# Altium schematic sheet EDU_High-Speed-Design_CPU_Power.SchDoc: CPU Power
size 558 x 431 mm; Date: not used; ApprovedBy: not used; CheckedBy: not used; Author: not used; DrawnBy: not used; Organization: not used; Address4: not used; SheetNumber: 12; SheetTotal: 26; Time: not used; ImagePath: not used; Application_BuildNumber: not used
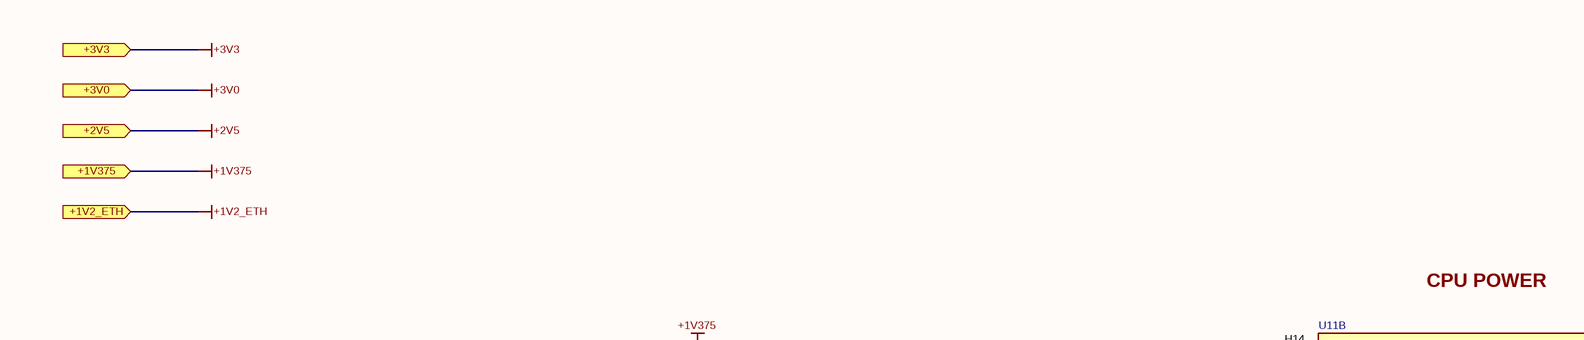
[diagram p0: EDU_High-Speed-Design_CPU_Power.SchDoc, top left]
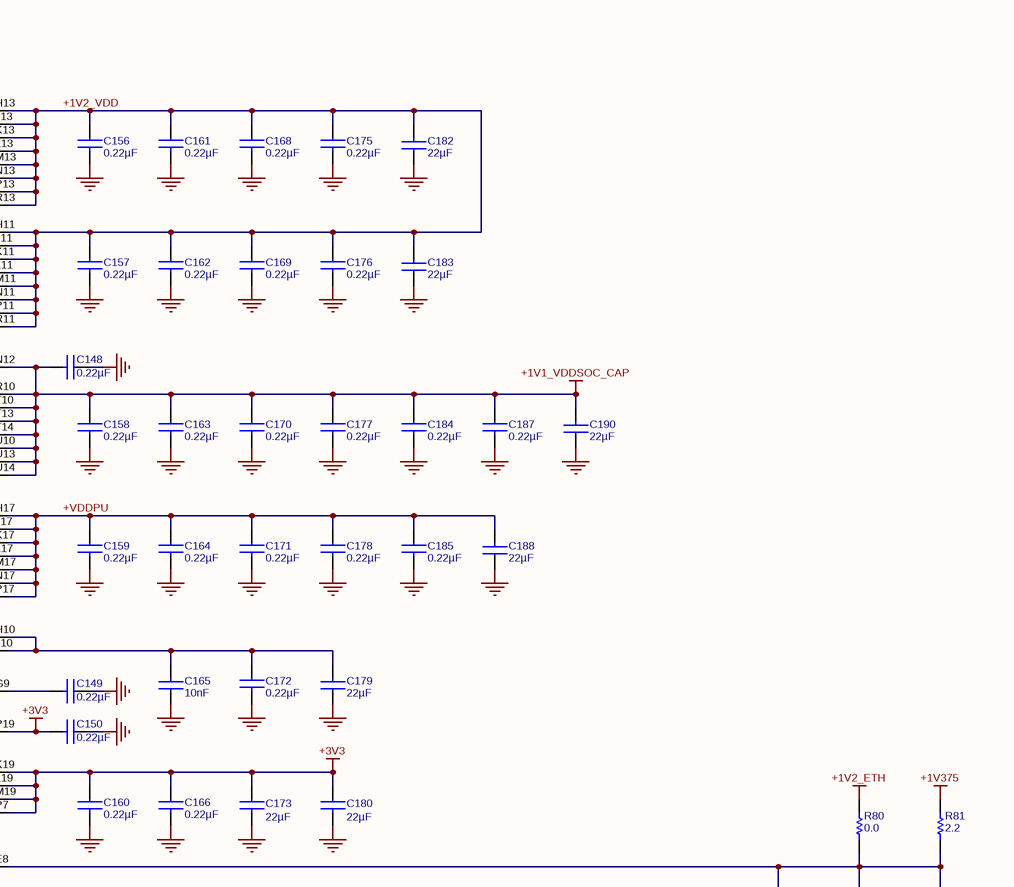
[diagram p1: EDU_High-Speed-Design_CPU_Power.SchDoc, top right]
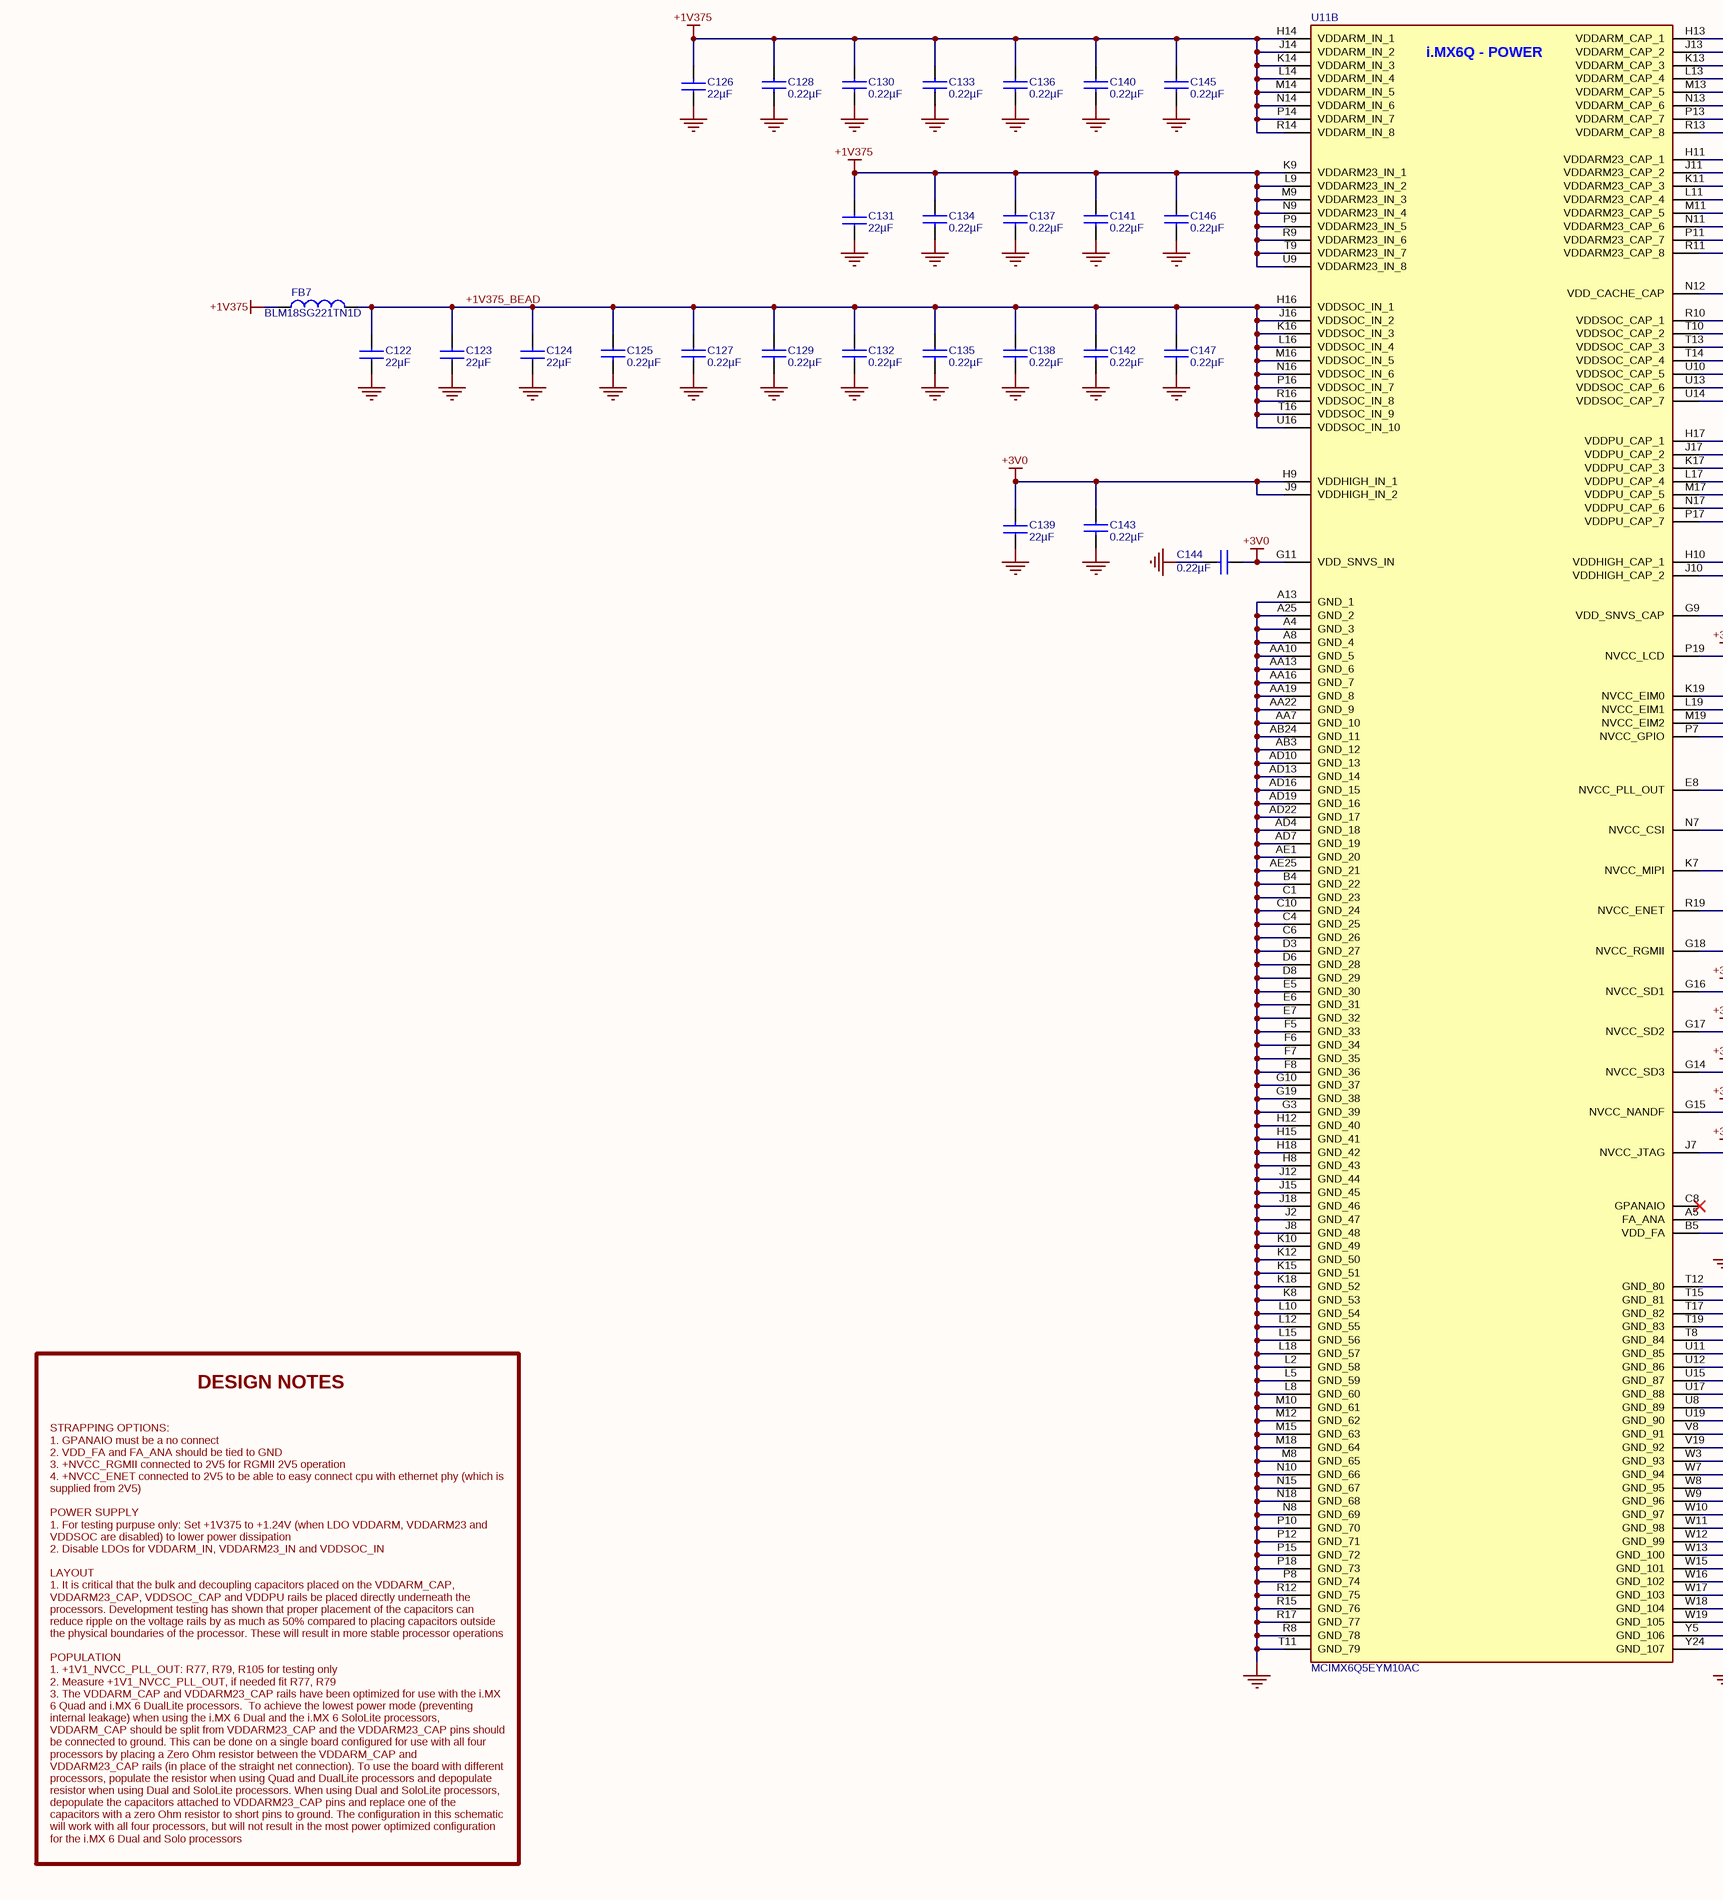
[diagram p2: EDU_High-Speed-Design_CPU_Power.SchDoc, bottom left]
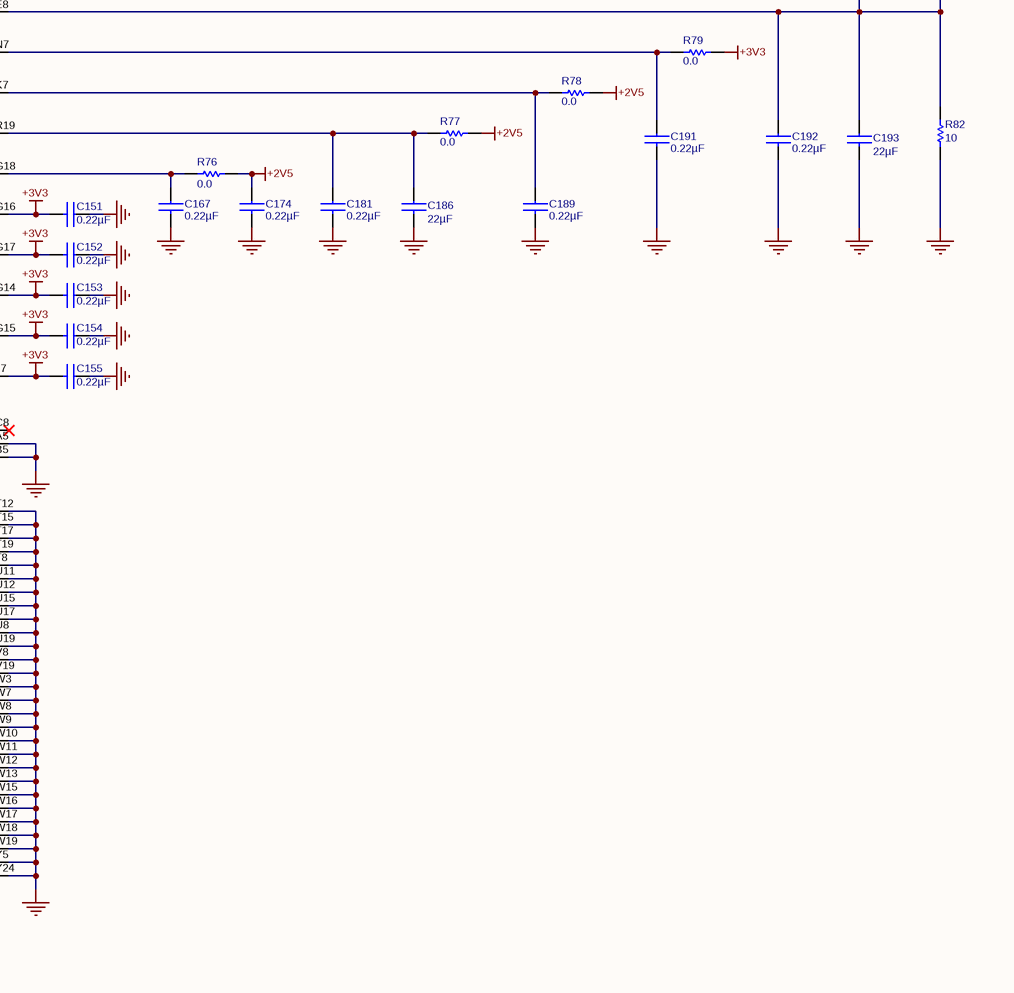
[diagram p3: EDU_High-Speed-Design_CPU_Power.SchDoc, bottom right]

## Parts
C122  22µF  [C0603]
C123  22µF  [C0603]
C124  22µF  [C0603]
C125  0.22µF  [C0402]
C126  22µF  [C0603]
C127  0.22µF  [C0402]
C128  0.22µF  [C0402]
C129  0.22µF  [C0402]
C130  0.22µF  [C0402]
C131  22µF  [C0603]
C132  0.22µF  [C0402]
C133  0.22µF  [C0402]
C134  0.22µF  [C0402]
C135  0.22µF  [C0402]
C136  0.22µF  [C0402]
C137  0.22µF  [C0402]
C138  0.22µF  [C0402]
C139  22µF  [C0603]
C140  0.22µF  [C0402]
C141  0.22µF  [C0402]
C142  0.22µF  [C0402]
C143  0.22µF  [C0402]
C144  0.22µF  [C0402]
C145  0.22µF  [C0402]
C146  0.22µF  [C0402]
C147  0.22µF  [C0402]
C148  0.22µF  [C0402]
C149  0.22µF  [C0402]
C150  0.22µF  [C0402]
C151  0.22µF  [C0402]
C152  0.22µF  [C0402]
C153  0.22µF  [C0402]
C154  0.22µF  [C0402]
C155  0.22µF  [C0402]
C156  0.22µF  [C0402]
C157  0.22µF  [C0402]
C158  0.22µF  [C0402]
C159  0.22µF  [C0402]
C160  0.22µF  [C0402]
C161  0.22µF  [C0402]
C162  0.22µF  [C0402]
C163  0.22µF  [C0402]
C164  0.22µF  [C0402]
C165  10nF  [C0402]
C166  0.22µF  [C0402]
C167  0.22µF  [C0402]
C168  0.22µF  [C0402]
C169  0.22µF  [C0402]
C170  0.22µF  [C0402]
C171  0.22µF  [C0402]
C172  0.22µF  [C0402]
C173  22µF  [C0603]
C174  0.22µF  [C0402]
C175  0.22µF  [C0402]
C176  0.22µF  [C0402]
C177  0.22µF  [C0402]
C178  0.22µF  [C0402]
C179  22µF  [C0603]
C180  22µF  [C0603]
C181  0.22µF  [C0402]
C182  22µF  [C0603]
C183  22µF  [C0603]
C184  0.22µF  [C0402]
C185  0.22µF  [C0402]
C186  22µF  [C0603]
C187  0.22µF  [C0402]
C188  22µF  [C0603]
C189  0.22µF  [C0402]
C190  22µF  [C0603]
C191  0.22µF  [C0402]
C192  0.22µF  [C0402]
C193  22µF  [C0603]
FB7  BLM18SG221TN1D  [L0603]
R76  0.0  [R0402]
R77  0.0  [R0402]
R78  0.0  [R0402]
R79  0.0  [R0402]
R80  0.0  [R0402]
R81  2.2  [R0402]
R82  10  [R0402]
U11  MCIMX6Q5EYM10AC  [MCIMX6Q5EYM10AC]  (part B of 15)

## Ports
+1V2_ETH (in), +1V375 (in), +2V5 (in), +3V0 (in), +3V3 (in)

## Nets
+1V1_VDDSOC_CAP: C148.2 C158.1 C163.1 C170.1 C177.1 C184.1 C187.1 C190.2 U11.N12(VDD_CACHE_CAP) U11.R10(VDDSOC_CAP_1) U11.T10(VDDSOC_CAP_2) U11.T13(VDDSOC_CAP_3) U11.T14(VDDSOC_CAP_4) U11.U10(VDDSOC_CAP_5) U11.U13(VDDSOC_CAP_6) U11.U14(VDDSOC_CAP_7)
+1V2_ETH: R80.1 ; port +1V2_ETH
+1V375: C126.2 C128.1 C130.1 C131.2 C133.1 C134.1 C136.1 C137.1 C140.1 C141.1 C145.1 C146.1 FB7.1 R81.2 U11.H14(VDDARM_IN_1) U11.J14(VDDARM_IN_2) U11.K9(VDDARM23_IN_1) U11.K14(VDDARM_IN_3) U11.L9(VDDARM23_IN_2) U11.L14(VDDARM_IN_4) U11.M9(VDDARM23_IN_3) U11.M14(VDDARM_IN_5) U11.N9(VDDARM23_IN_4) U11.N14(VDDARM_IN_6) U11.P9(VDDARM23_IN_5) U11.P14(VDDARM_IN_7) U11.R9(VDDARM23_IN_6) U11.R14(VDDARM_IN_8) U11.T9(VDDARM23_IN_7) U11.U9(VDDARM23_IN_8) ; port +1V375
+2V5: C174.1 R76.1 R77.2 R78.2 ; port +2V5
+3V0: C139.2 C143.1 C144.1 U11.G11(VDD_SNVS_IN) U11.H9(VDDHIGH_IN_1) U11.J9(VDDHIGH_IN_2) ; port +3V0
+3V3: C150.2 C151.2 C152.2 C153.2 C154.2 C155.2 C160.1 C166.1 C173.1 C180.1 R79.2 U11.G14(NVCC_SD3) U11.G15(NVCC_NANDF) U11.G16(NVCC_SD1) U11.G17(NVCC_SD2) U11.J7(NVCC_JTAG) U11.K19(NVCC_EIM0) U11.L19(NVCC_EIM1) U11.M19(NVCC_EIM2) U11.P7(NVCC_GPIO) U11.P19(NVCC_LCD) ; port +3V3
GND: C122.1 C123.1 C124.1 C125.2 C126.1 C127.2 C128.2 C129.2 C130.2 C131.1 C132.2 C133.2 C134.2 C135.2 C136.2 C137.2 C138.2 C139.1 C140.2 C141.2 C142.2 C143.2 C144.2 C145.2 C146.2 C147.2 C148.1 C149.1 C150.1 C151.1 C152.1 C153.1 C154.1 C155.1 C156.2 C157.2 C158.2 C159.2 C160.2 C161.2 C162.2 C163.2 C164.2 C165.1 C166.2 C167.2 C168.2 C169.2 C170.2 C171.2 C172.2 C173.2 C174.2 C175.2 C176.2 C177.2 C178.2 C179.1 C180.2 C181.2 C182.1 C183.1 C184.2 C185.2 C186.2 C187.2 C188.1 C189.2 C190.1 C191.2 C192.2 C193.2 R82.2 U11.A4(GND_3) U11.A5(FA_ANA) U11.A8(GND_4) U11.A13(GND_1) U11.A25(GND_2) U11.AA7(GND_10) U11.AA10(GND_5) U11.AA13(GND_6) U11.AA16(GND_7) U11.AA19(GND_8) U11.AA22(GND_9) U11.AB3(GND_12) U11.AB24(GND_11) U11.AD4(GND_18) U11.AD7(GND_19) U11.AD10(GND_13) U11.AD13(GND_14) U11.AD16(GND_15) U11.AD19(GND_16) U11.AD22(GND_17) U11.AE1(GND_20) U11.AE25(GND_21) U11.B4(GND_22) U11.B5(VDD_FA) U11.C1(GND_23) U11.C4(GND_25) U11.C6(GND_26) U11.C10(GND_24) U11.D3(GND_27) U11.D6(GND_28) U11.D8(GND_29) U11.E5(GND_30) U11.E6(GND_31) U11.E7(GND_32) U11.F5(GND_33) U11.F6(GND_34) U11.F7(GND_35) U11.F8(GND_36) U11.G3(GND_39) U11.G10(GND_37) U11.G19(GND_38) U11.H8(GND_43) U11.H12(GND_40) U11.H15(GND_41) U11.H18(GND_42) U11.J2(GND_47) U11.J8(GND_48) U11.J12(GND_44) U11.J15(GND_45) U11.J18(GND_46) U11.K8(GND_53) U11.K10(GND_49) U11.K12(GND_50) U11.K15(GND_51) U11.K18(GND_52) U11.L2(GND_58) U11.L5(GND_59) U11.L8(GND_60) U11.L10(GND_54) U11.L12(GND_55) U11.L15(GND_56) U11.L18(GND_57) U11.M8(GND_65) U11.M10(GND_61) U11.M12(GND_62) U11.M15(GND_63) U11.M18(GND_64) U11.N8(GND_69) U11.N10(GND_66) U11.N15(GND_67) U11.N18(GND_68) U11.P8(GND_74) U11.P10(GND_70) U11.P12(GND_71) U11.P15(GND_72) U11.P18(GND_73) U11.R8(GND_78) U11.R12(GND_75) U11.R15(GND_76) U11.R17(GND_77) U11.T8(GND_84) U11.T11(GND_79) U11.T12(GND_80) U11.T15(GND_81) U11.T17(GND_82) U11.T19(GND_83) U11.U8(GND_89) U11.U11(GND_85) U11.U12(GND_86) U11.U15(GND_87) U11.U17(GND_88) U11.U19(GND_90) U11.V8(GND_91) U11.V19(GND_92) U11.W3(GND_93) U11.W7(GND_94) U11.W8(GND_95) U11.W9(GND_96) U11.W10(GND_97) U11.W11(GND_98) U11.W12(GND_99) U11.W13(GND_100) U11.W15(GND_101) U11.W16(GND_102) U11.W17(GND_103) U11.W18(GND_104) U11.W19(GND_105) U11.Y5(GND_106) U11.Y24(GND_107)
+1V2_VDD: C156.1 C157.1 C161.1 C162.1 C168.1 C169.1 C175.1 C176.1 C182.2 C183.2 U11.H11(VDDARM23_CAP_1) U11.H13(VDDARM_CAP_1) U11.J11(VDDARM23_CAP_2) U11.J13(VDDARM_CAP_2) U11.K11(VDDARM23_CAP_3) U11.K13(VDDARM_CAP_3) U11.L11(VDDARM23_CAP_4) U11.L13(VDDARM_CAP_4) U11.M11(VDDARM23_CAP_5) U11.M13(VDDARM_CAP_5) U11.N11(VDDARM23_CAP_6) U11.N13(VDDARM_CAP_6) U11.P11(VDDARM23_CAP_7) U11.P13(VDDARM_CAP_7) U11.R11(VDDARM23_CAP_8) U11.R13(VDDARM_CAP_8)
+1V375_BEAD: C122.2 C123.2 C124.2 C125.1 C127.1 C129.1 C132.1 C135.1 C138.1 C142.1 C147.1 FB7.2 U11.H16(VDDSOC_IN_1) U11.J16(VDDSOC_IN_2) U11.K16(VDDSOC_IN_3) U11.L16(VDDSOC_IN_4) U11.M16(VDDSOC_IN_5) U11.N16(VDDSOC_IN_6) U11.P16(VDDSOC_IN_7) U11.R16(VDDSOC_IN_8) U11.T16(VDDSOC_IN_9) U11.U16(VDDSOC_IN_10)
+VDDPU: C159.1 C164.1 C171.1 C178.1 C185.1 C188.2 U11.H17(VDDPU_CAP_1) U11.J17(VDDPU_CAP_2) U11.K17(VDDPU_CAP_3) U11.L17(VDDPU_CAP_4) U11.M17(VDDPU_CAP_5) U11.N17(VDDPU_CAP_6) U11.P17(VDDPU_CAP_7)
NetC149_2: C149.2 U11.G9(VDD_SNVS_CAP)
NetC165_2: C165.2 C172.1 C179.2 U11.H10(VDDHIGH_CAP_1) U11.J10(VDDHIGH_CAP_2)
NetC167_1: C167.1 R76.2 U11.G18(NVCC_RGMII)
NetC181_1: C181.1 C186.1 R77.1 U11.R19(NVCC_ENET)
NetC189_1: C189.1 R78.1 U11.K7(NVCC_MIPI)
NetC191_1: C191.1 R79.1 U11.N7(NVCC_CSI)
NetC192_1: C192.1 C193.1 R80.2 R81.1 R82.1 U11.E8(NVCC_PLL_OUT)

Not connected (* = marked no-connect by the designer): U11 C8(GPANAIO)*

## Notes on the sheet
- CPU POWER
- DESIGN NOTES
- STRAPPING OPTIONS:
  1. GPANAIO must be a no connect
  2. VDD_FA and FA_ANA should be tied to GND
  3. +NVCC_RGMII connected to 2V5 for RGMII 2V5 operation
  4. +NVCC_ENET connected to 2V5 to be able to easy connect cpu with ethernet phy (which is supplied from 2V5)
  POWER SUPPLY
  1. For testing purpuse only: Set +1V375 to +1.24V (when LDO VDDARM, VDDARM23 and VDDSOC are disabled) to lower power dissipation
  2. Disable LDOs for VDDARM_IN, VDDARM23_IN and VDDSOC_IN
  LAYOUT
  1. It is critical that the bulk and decoupling capacitors placed on the VDDARM_CAP, VDDARM23_CAP, VDDSOC_CAP and VDDPU rails be placed directly underneath the processors. Development testing has shown that proper placement of the capacitors can reduce ripple on the voltage rails by as much as 50% compared to placing capacitors outside the physical boundaries of the processor. These will result in more stable processor operations
  POPULATION
  1. +1V1_NVCC_PLL_OUT: R77, R79, R105 for testing only
  2. Measure +1V1_NVCC_PLL_OUT, if needed fit R77, R79
  3. The VDDARM_CAP and VDDARM23_CAP rails have been optimized for use with the i.MX 6 Quad and i.MX 6 DualLite processors.  To achieve the lowest power mode (preventing internal leakage) when using the i.MX 6 Dual and the i.MX 6 SoloLite processors, VDDARM_CAP should be split from VDDARM23_CAP and the VDDARM23_CAP pins should be connected to ground. This can be done on a single board configured for use with all four processors by placing a Zero Ohm resistor between the VDDARM_CAP and VDDARM23_CAP rails (in place of the straight net connection). To use the board with different processors, populate the resistor when using Quad and DualLite processors and depopulate resistor when using Dual and SoloLite processors. When using Dual and SoloLite processors, depopulate the capacitors attached to VDDARM23_CAP pins and replace one of the capacitors with a zero Ohm resistor to short pins to ground. The configuration in this schematic will work with all four processors, but will not result in the most power optimized configuration for the i.MX 6 Dual and Solo processors
- Title:
- Date:
- Size C
- Project:
- Number:
- Time:
- Sheet
- Revision
- of
- Engineer:
- File:
- (in symbol MCIMX6Q5EYM10AC, part B) i.MX6Q - POWER

## Library data of the parts
C122-C124 C126 C131 C139 C173 C179 C180 C182 C183 C186 C188 C190 C193 = GRM188R60G226MEA0L: CAP CER 22UF 4V 20% X5R 0603; Manufacturer 1: Murata Electronics North America; Supplier 1: Digi-Key; Supplier Part Number 1: 490-5526-1-ND; Manufacturer Part Number 1: GRM188R60G226MEA0L; Capacitance: 22µF; Voltage: 4V; ComponentLink1URL: http://www.murata.com/products/catalog/pdf/c02e.pdf; ComponentLink1Description: http://www.murata.com/products/catalog/pdf/c02e.pdf
C125 C127-C130 C132-C138 C140-C164 C166-C172 C174-C178 C181 C184 C185 C187 C189 C191 C192 = C1005X5R1E224M: CAP CER .22UF 25V X5R 20% 0402; Manufacturer 1: TDK Corporation; Capacitance: 0.22µF; Manufacturer Part Number 1: C1005X5R1E224M; Voltage: 25V; Supplier 1: Digi-Key; Supplier Part Number 1: 445-5945-1-ND; ComponentLink1URL: http://www.tdk.co.jp/tefe02/e412_c.pdf; ComponentLink1Description: http://www.tdk.co.jp/tefe02/e412_c.pdf
C165 = C1005X7R1C103K: CAP CER 10000PF 16V X7R 10% 0402; Manufacturer: TDK Corporation; Capacitance: 10nF; Manufacturer Part Number: C1005X7R1C103K; Voltage: 16V; Supplier 1: Digi-Key; Supplier Part Number 1: 445-1262-1-ND; ComponentLink1URL: http://www.tdk.co.jp/tefe02/e412_c.pdf; ComponentLink1Description: http://www.tdk.co.jp/tefe02/e412_c.pdf
FB7 = BLM18SG221TN1D: FERRITE CHIP 220 OHM 2500MA 0603; Manufacturer 1: Murata Electronics North America; Supplier 1: Digi-Key; Supplier Part Number 1: 490-5225-1-ND; Manufacturer Part Number 1: BLM18SG221TN1D; ComponentLink1URL: http://search.murata.co.jp/Ceramy/image/img/PDF/ENG/L0110S0100BLM18S.pdf; ComponentLink1Description: http://search.murata.co.jp/Ceramy/image/img/PDF/ENG/L0110S0100BLM18S.pdf
R76-R80 = RC0402JR-070RL: RES 0.0 OHM 1/16W 0402 SMD; Manufacturer 1: Yageo; Manufacturer Part Number 1: RC0402JR-070RL; Resistance: 0.0; Supplier 1: Digi-Key; Supplier Part Number 1: 311-0.0JRCT-ND; ComponentLink1URL: http://www.yageo.com/documents/recent/PYu-RC0402_51_RoHS_L_6.pdf; ComponentLink1Description: http://www.yageo.com/documents/recent/PYu-RC0402_51_RoHS_L_6.pdf
R81 = CRCW04022R20FKED: RES 2.20 OHM 1/16W 1% 0402 SMD; Manufacturer 1: Vishay Dale; Supplier 1: Digi-Key; Supplier Part Number 1: 541-2.20LLCT-ND; Manufacturer Part Number 1: CRCW04022R20FKED; Resistance: 2.2; ComponentLink1URL: http://www.vishay.com/docs/20035/dcrcwe3.pdf; ComponentLink1Description: http://www.vishay.com/docs/20035/dcrcwe3.pdf
R82 = RC0402FR-0710RL: RES 10.0 OHM 1/16W 1% 0402 SMD; Manufacturer 1: Yageo; Manufacturer Part Number 1: RC0402FR-0710RL; Resistance: 10; Supplier 1: Digi-Key; Supplier Part Number 1: 311-10.0LRCT-ND; ComponentLink1URL: http://www.yageo.com/documents/recent/PYu-RC0402_51_RoHS_L_6.pdf; ComponentLink1Description: http://www.yageo.com/documents/recent/PYu-RC0402_51_RoHS_L_6.pdf
U11 = MCIMX6Q5EYM10AC: IC MCU 32BIT ARM QUAD 624FCBGA; Manufacturer 1: Freescale Semiconductor; Supplier 1: Digi-Key; Manufacturer Part Number 1: MCIMX6Q5EYM10AC; Supplier Part Number 1: MCIMX6Q5EYM10AC-ND